# Altium schematic sheet 03-MCU.SchDoc: MCU
size A2; DocumentNumber: 3; SheetNumber: 3; SheetTotal: 5
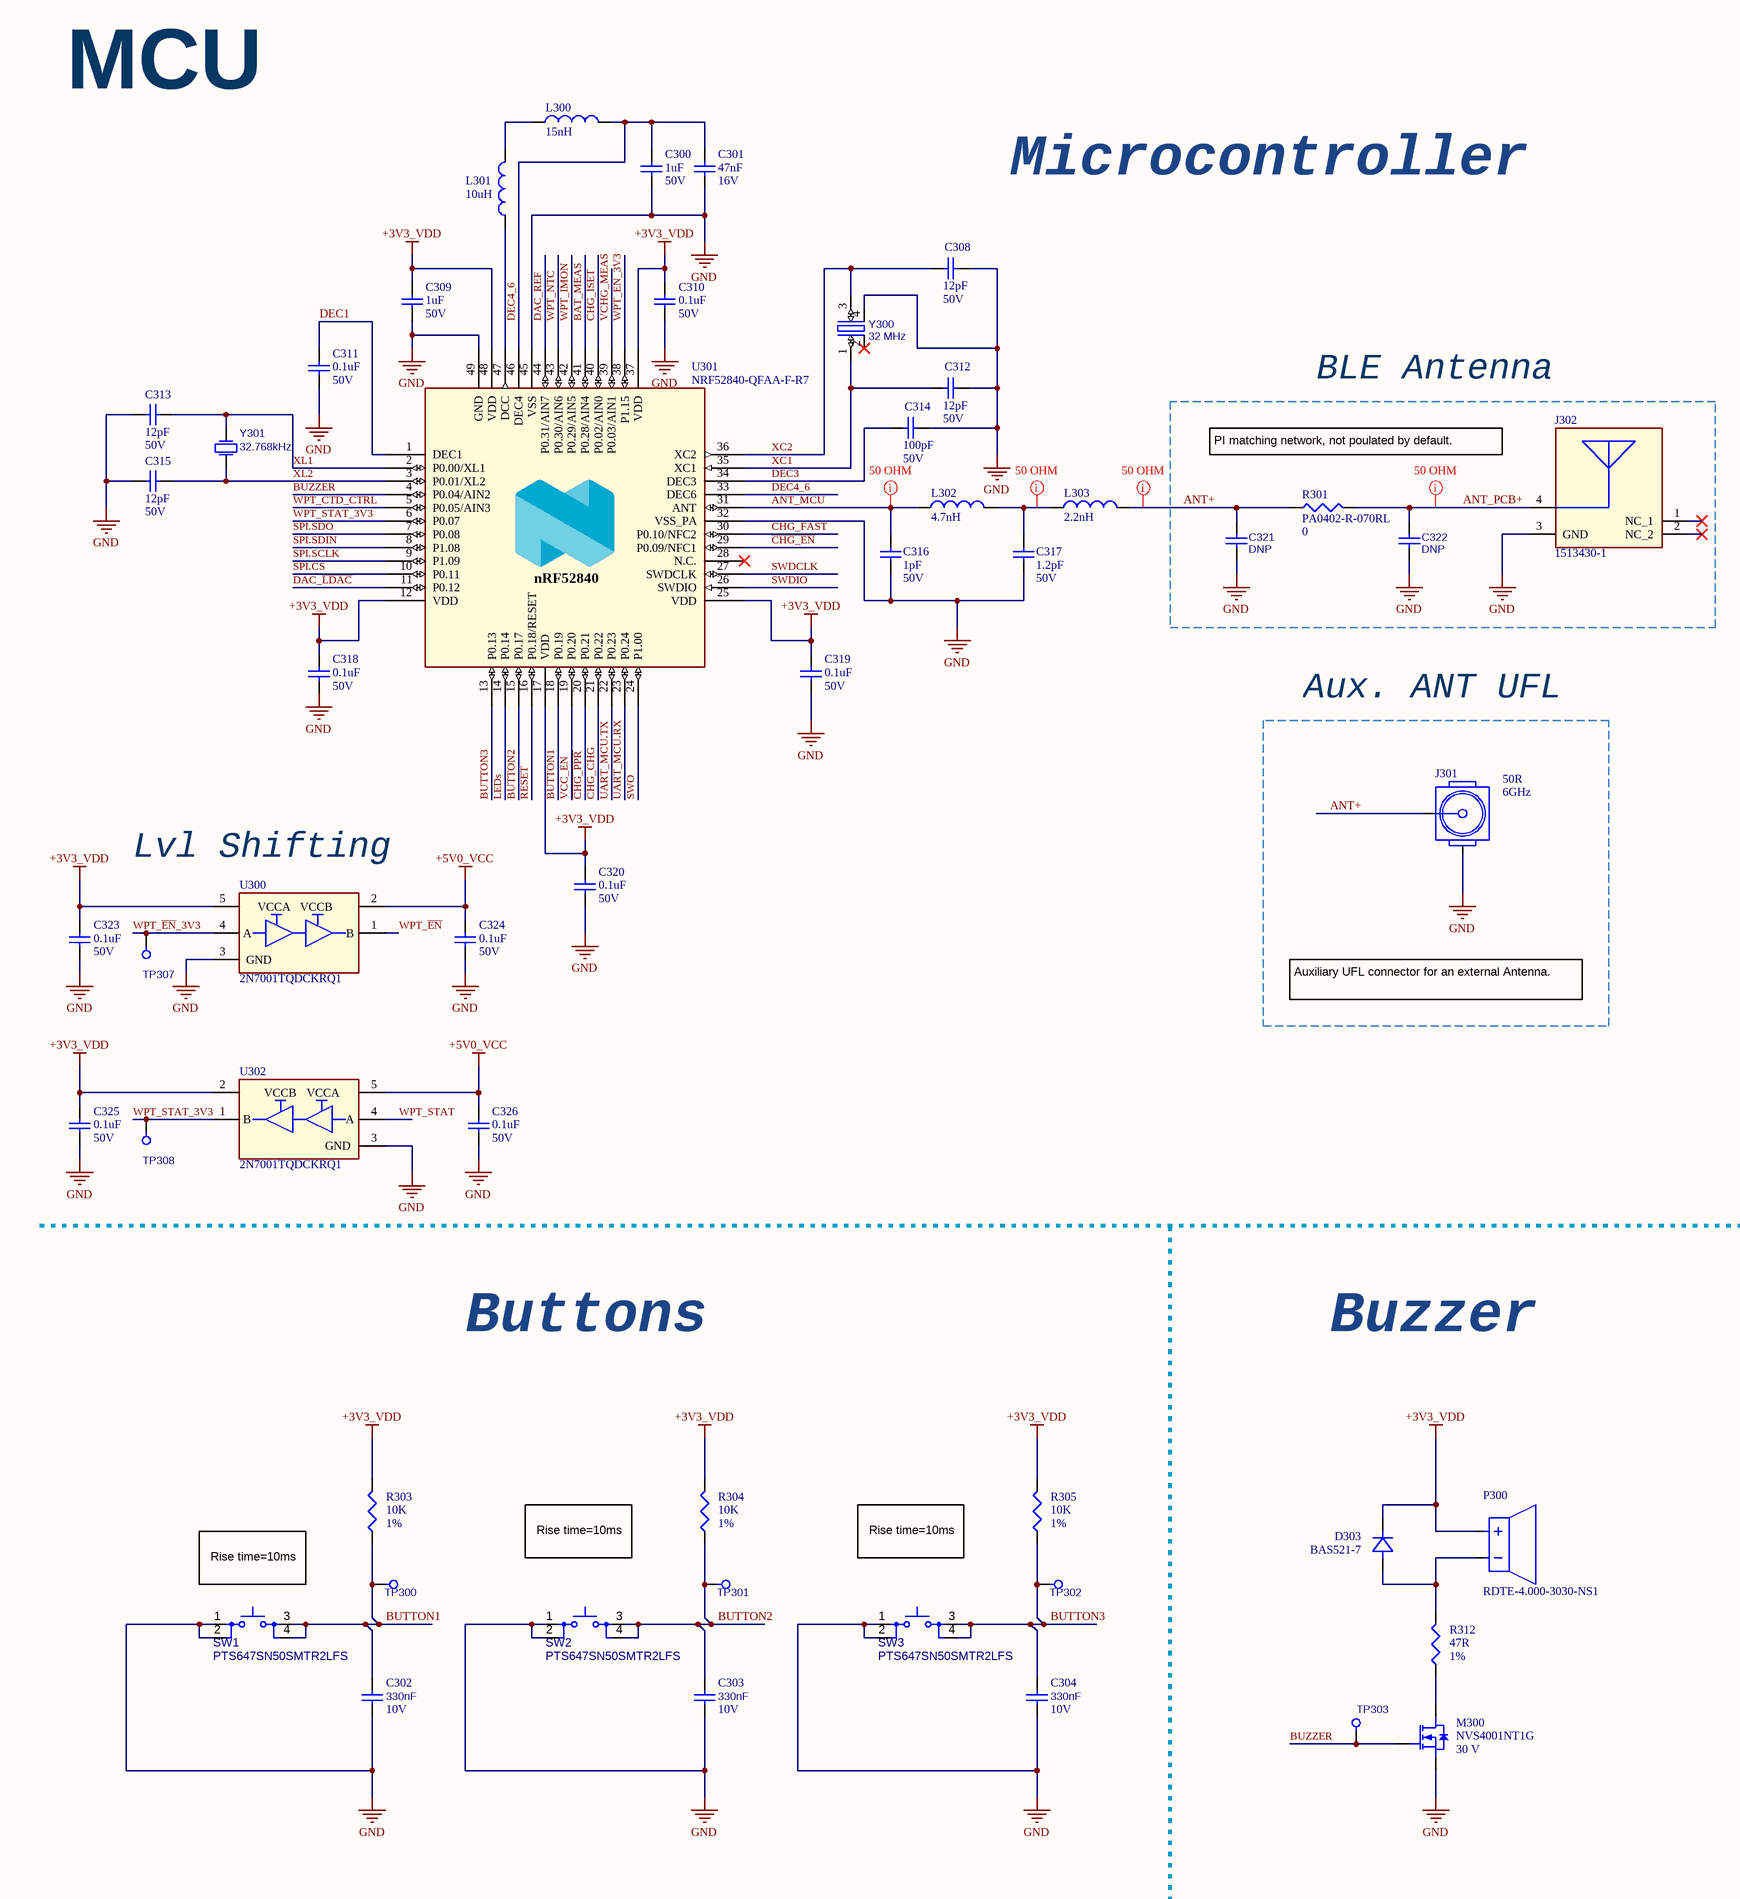
[diagram p0: 03-MCU.SchDoc, left]
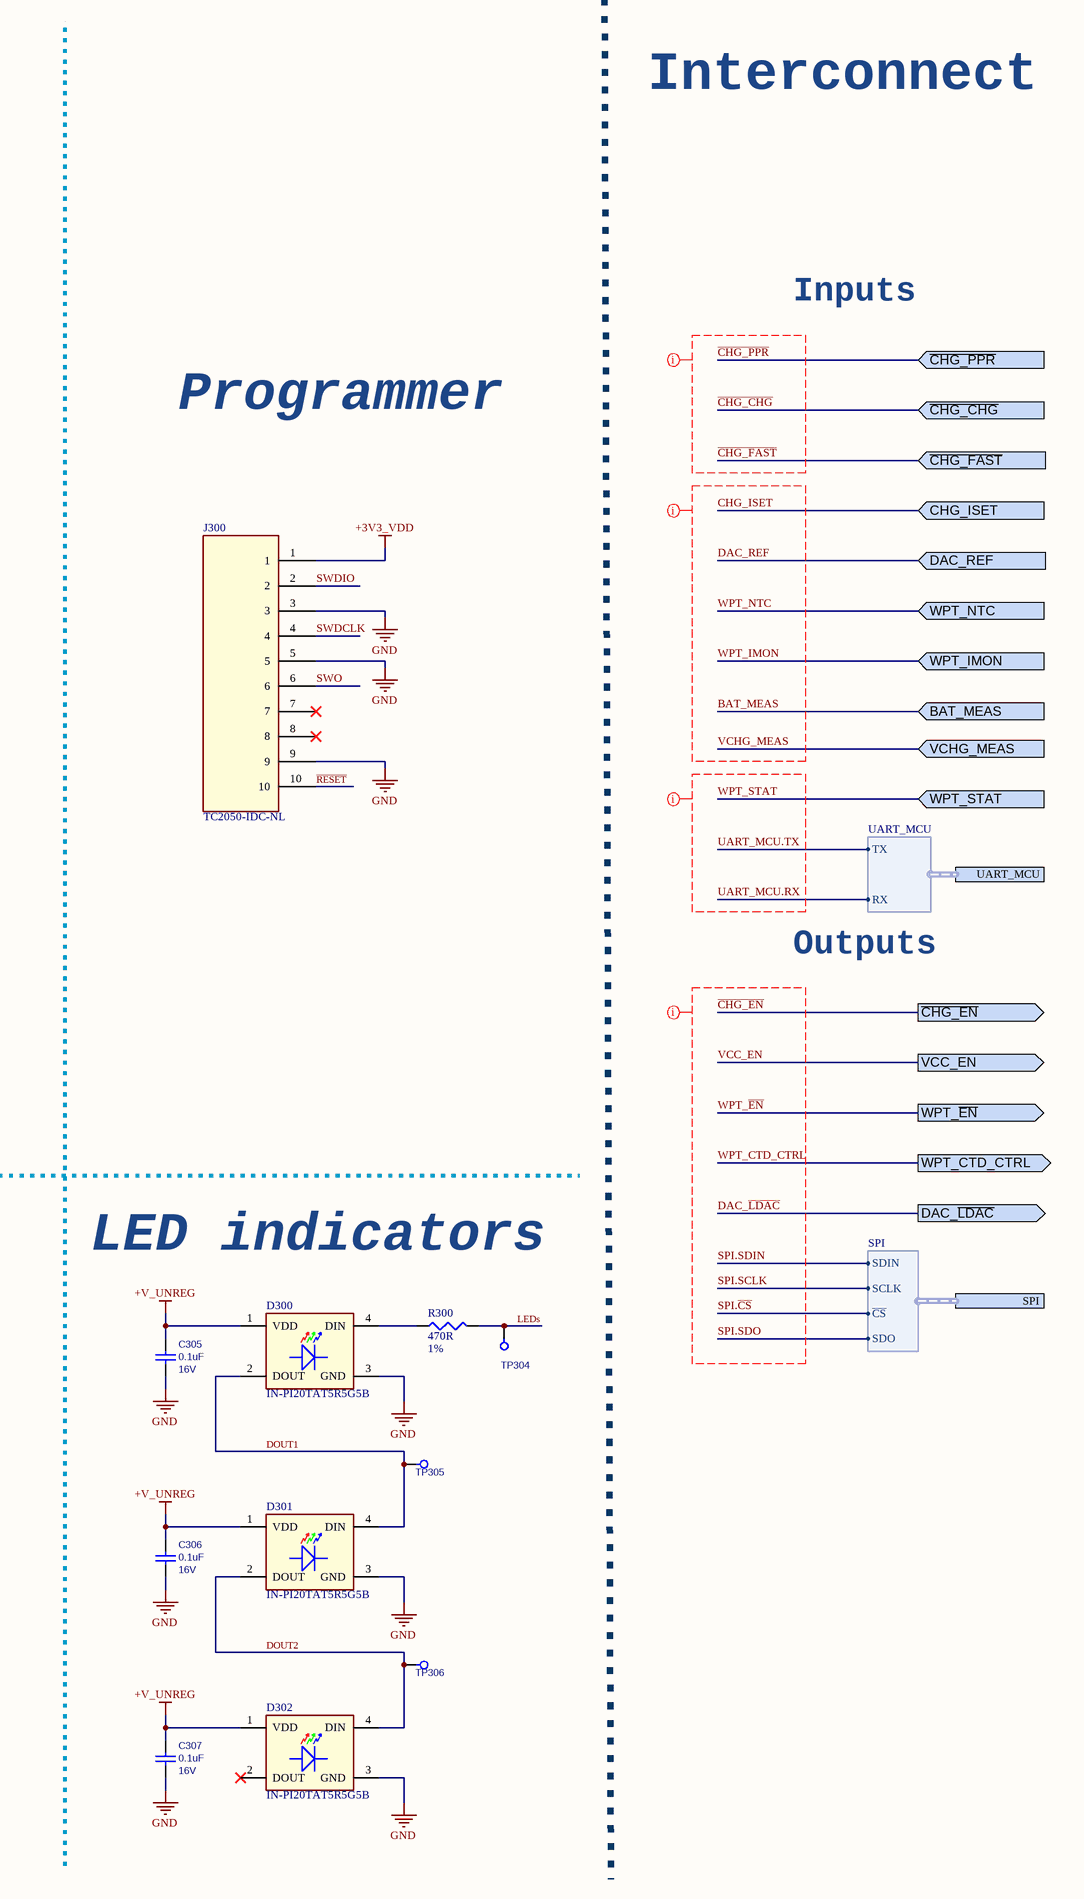
[diagram p1: 03-MCU.SchDoc, right]

## Parts
C300  value 1uF  Voltage Rating: 50V  [C0402]  (hidden comment: GRM155R61H105KE05D)
C301  value 47nF  Voltage Rating: 16V  [C0402]  (hidden comment: GRM155R61C473KA01D)
C302  value 330nF  Rated DC Voltage (URdc): 10V  [C0402]  (hidden comment: GRM155R61A334KE15D)
C303  value 330nF  Rated DC Voltage (URdc): 10V  [C0402]  (hidden comment: GRM155R61A334KE15D)
C304  value 330nF  Rated DC Voltage (URdc): 10V  [C0402]  (hidden comment: GRM155R61A334KE15D)
C305  value 0.1uF  Rating: 16V  [C0402]  (hidden comment: GCM155R71C104KA55)
C306  value 0.1uF  Rating: 16V  [C0402]  (hidden comment: GCM155R71C104KA55)
C307  value 0.1uF  Rating: 16V  [C0402]  (hidden comment: GCM155R71C104KA55)
C308  value 12pF  Voltage Rating: 50V  [C0402]  (hidden comment: GJM1555C1H120FB01D)
C309  value 1uF  Voltage Rating: 50V  [C0402]  (hidden comment: GRM155R61H105KE05D)
C310  value 0.1uF  Voltage Rating: 50V  [C0402]  (hidden comment: GRM155R61H104KE14D)
C311  value 0.1uF  Voltage Rating: 50V  [C0402]  (hidden comment: GRM155R61H104KE14D)
C312  value 12pF  Voltage Rating: 50V  [C0402]  (hidden comment: GJM1555C1H120FB01D)
C313  value 12pF  Voltage Rating: 50V  [C0402]  (hidden comment: GJM1555C1H120FB01D)
C314  value 100pF  Voltage Rating: 50V  [C0402]  (hidden comment: GRM1555C1H101JA01D)
C315  value 12pF  Voltage Rating: 50V  [C0402]  (hidden comment: GJM1555C1H120FB01D)
C316  value 1pF  Voltage Rating: 50V  [C0402]  (hidden comment: GCM1555C1H1R0JA16D)
C317  value 1.2pF  Voltage Rating: 50V  [C0402]  (hidden comment: GJM1555C1H1R2WB01J)
C318  value 0.1uF  Voltage Rating: 50V  [C0402]  (hidden comment: GRM155R61H104KE14D)
C319  value 0.1uF  Voltage Rating: 50V  [C0402]  (hidden comment: GRM155R61H104KE14D)
C320  value 0.1uF  Voltage Rating: 50V  [C0402]  (hidden comment: GRM155R61H104KE14D)
C321  value DNP  [C0402]  (hidden comment: Capacitor, DNP, 0402)
C322  value DNP  [C0402]  (hidden comment: Capacitor, DNP, 0402)
C323  value 0.1uF  Voltage Rating: 50V  [C0402]  (hidden comment: GRM155R61H104KE14D)
C324  value 0.1uF  Voltage Rating: 50V  [C0402]  (hidden comment: GRM155R61H104KE14D)
C325  value 0.1uF  Voltage Rating: 50V  [C0402]  (hidden comment: GRM155R61H104KE14D)
C326  value 0.1uF  Voltage Rating: 50V  [C0402]  (hidden comment: GRM155R61H104KE14D)
D300  IN-PI20TAT5R5G5B  [INPI20TAT5R5G5B]
D301  IN-PI20TAT5R5G5B  [INPI20TAT5R5G5B]
D302  IN-PI20TAT5R5G5B  [INPI20TAT5R5G5B]
D303  BAS521-7  [BAS521_SOD523]
J300  TC2050-IDC-NL  [TC2050-IDC-NL]
J301  Characteristic Impedance: 50R  Operating Frequency-Max: 6GHz  [FP-U_FL-R-SMT-1_10-MFG]  (hidden comment: U.FL-R-SMT-1(10))
J302  1513430-1  [15134301]
L300  value 15nH  [L0402_B]  (hidden comment: LQG15HS15NG02D)
L301  value 10uH  [L0603_B]  (hidden comment: ASMCI-0603-100M-T)
L302  value 4.7nH  [L0402_B]  (hidden comment: LQG15HS4N7B02D)
L303  value 2.2nH  [L0402_B]  (hidden comment: LQG15HS2N2B02D)
M300  NVS4001NT1G  Vds breakdown: 30 V  [NVS4001NT1G-SC-70-3]
P300  RDTE-4.000-3030-NS1  [RDTE-4.000-3030-NS1]
R300  value 470R  Tolerance: 1%  [R0402]  (hidden comment: RC0402FR-13470RL)
R301  PA0402-R-070RL  value 0  [R0402]
R303  value 10K  Tolerance: 1%  [R0402]  (hidden comment: CRCW040210K0FKED)
R304  value 10K  Tolerance: 1%  [R0402]  (hidden comment: CRCW040210K0FKED)
R305  value 10K  Tolerance: 1%  [R0402]  (hidden comment: CRCW040210K0FKED)
R312  value 47R  Tolerance: 1%  [R0402]  (hidden comment: CRCW040247R0FKED)
SW1  PTS647SN50SMTR2LFS  [CK_PTS647]
SW2  PTS647SN50SMTR2LFS  [CK_PTS647]
SW3  PTS647SN50SMTR2LFS  [CK_PTS647]
TP300  Test Point  [testpad_0.9mm]  (value not drawn)  (no BOM)
TP301  Test Point  [testpad_0.9mm]  (value not drawn)  (no BOM)
TP302  Test Point  [testpad_0.9mm]  (value not drawn)  (no BOM)
TP303  Test Point  [testpad_0.9mm]  (value not drawn)  (no BOM)
TP304  Test Point  [testpad_0.9mm]  (value not drawn)  (no BOM)
TP305  Test Point  [testpad_0.9mm]  (value not drawn)  (no BOM)
TP306  Test Point  [testpad_0.9mm]  (value not drawn)  (no BOM)
TP307  Test Point  [testpad_0.9mm]  (value not drawn)  (no BOM)
TP308  Test Point  [testpad_0.9mm]  (value not drawn)  (no BOM)
U300  2N7001TQDCKRQ1  [SOT65P210X110-5N]
U301  NRF52840-QFAA-F-R7  [QFN40P600X600X90-48N]
U302  2N7001TQDCKRQ1  [SOT65P210X110-5N]
Y300  value 32 MHz  [XTAL_ECS-SMD-CRYSTAL-10-48-CKY-TR]  (hidden comment: ECS-320-10-48-CKY-TR)
Y301  value 32.768kHz  [XTAL_ECS-.327-9-34B-C-TR]  (hidden comment: ECS-.327-9-34B-C-TR)

## Blocks framed on the sheet
BLE Antenna: C321 C322 J302 R301
Aux. ANT UFL: J301

## Ports
BAT_MEAS (in), CHG_ISET (in), DAC_REF (in), DAC_~{LDAC} (out), SPI (harness SPI), UART_MCU (harness UART_MCU), VCC_EN (out), VCHG_MEAS (in), WPT_CTD_CTRL (out), WPT_IMON (in), WPT_NTC (in), WPT_STAT (in), WPT_~{EN} (out), ~{CHG_CHG} (in), ~{CHG_EN} (out), ~{CHG_FAST} (in), ~{CHG_PPR} (in)

## Harnesses
UART_MCU: TX, RX
SPI: SDIN, SCLK, ~{CS}, SDO

## Nets
+3V3_VDD: C309.2 C310.2 C318.2 C319.2 C320.2 C323.2 C325.2 D303.1 J300.1 P300.1(+) R303.2 R304.2 R305.2 U300.5(VCCA) U301.12(VDD) U301.17(VDD) U301.25(VDD) U301.37(VDD) U301.48(VDD) U302.2(VCCB)
+5V0_VCC: C324.2 C326.2 U300.2(VCCB) U302.5(VCCA)
+V_UNREG: C305.2 C306.2 C307.2 D300.1(VDD) D301.1(VDD) D302.1(VDD)
GND: C300.1 C301.1 C302.1 C303.1 C304.1 C305.1 C306.1 C307.1 C308.2 C309.1 C310.1 C311.1 C312.2 C313.1 C314.2 C315.1 C316.1 C317.1 C318.1 C319.1 C320.1 C321.1 C322.1 C323.1 C324.1 C325.1 C326.1 D300.3(GND) D301.3(GND) D302.3(GND) J300.3 J300.5 J300.9 J301.2 J302.3(GND) M300.2(S) SW1.1 SW1.2 SW2.1 SW2.2 SW3.1 SW3.2 U300.3(GND) U301.32(VSS_PA) U301.45(VSS) U301.49(GND) U302.3(GND) Y300.4(GND)
ANT+: C321.2 J301.1 L303.2 R301.1
ANT_MCU: C316.2 L302.1 U301.31(ANT)
ANT_PCB+: C322.2 J302.4(50_OHM_FEED_POINT) R301.2
BAT_MEAS: U301.41(P0.28/AIN4) ; port BAT_MEAS
BUTTON1: C302.2 R303.1 SW1.3 SW1.4 TP300.1 U301.18(P0.19)
BUTTON2: C303.2 R304.1 SW2.3 SW2.4 TP301.1 U301.15(P0.17)
BUTTON3: C304.2 R305.1 SW3.3 SW3.4 TP302.1 U301.13(P0.13)
BUZZER: M300.1(G) TP303.1 U301.4(P0.04/AIN2)
~{CHG_CHG}: U301.21(P0.22) ; port ~{CHG_CHG}
~{CHG_EN}: U301.29(P0.09/NFC1) ; port ~{CHG_EN}
~{CHG_FAST}: U301.30(P0.10/NFC2) ; port ~{CHG_FAST}
~{CHG_PPR}: U301.20(P0.21) ; port ~{CHG_PPR}
CHG_ISET: U301.40(P0.02/AIN0) ; port CHG_ISET
DAC_~{LDAC}: U301.11(P0.12) ; port DAC_~{LDAC}
DAC_REF: U301.44(P0.31/AIN7) ; port DAC_REF
DEC1: C311.2 U301.1(DEC1)
DEC3: C314.1 U301.34(DEC3)
DEC4_6: C300.2 C301.2 L300.2 U301.33(DEC6) U301.46(DEC4)
DOUT1: D300.2(DOUT) D301.4(DIN) TP305.1
DOUT2: D301.2(DOUT) D302.4(DIN) TP306.1
LEDs: R300.2 TP304.1 U301.14(P0.14)
~{RESET}: J300.10 U301.16(P0.18/RESET)
SPI.~{CS}: U301.10(P0.11) ; port SPI.~{CS}
SPI.SCLK: U301.9(P1.09) ; port SPI.SCLK
SPI.SDIN: U301.8(P1.08) ; port SPI.SDIN
SPI.SDO: U301.7(P0.08) ; port SPI.SDO
SWDCLK: J300.4 U301.27(SWDCLK)
SWDIO: J300.2 U301.26(SWDIO)
SWO: J300.6 U301.24(P1.00)
UART_MCU.RX: U301.23(P0.24) ; port UART_MCU.RX
UART_MCU.TX: U301.22(P0.23) ; port UART_MCU.TX
VCC_EN: U301.19(P0.20) ; port VCC_EN
VCHG_MEAS: U301.39(P0.03/AIN1) ; port VCHG_MEAS
WPT_CTD_CTRL: U301.5(P0.05/AIN3) ; port WPT_CTD_CTRL
WPT_~{EN}: U300.1(B) ; port WPT_~{EN}
WPT_~{EN}_3V3: TP307.1 U300.4(A) U301.38(P1.15)
WPT_IMON: U301.42(P0.29/AIN5) ; port WPT_IMON
WPT_NTC: U301.43(P0.30/AIN6) ; port WPT_NTC
WPT_STAT: U302.4(A) ; port WPT_STAT
WPT_STAT_3V3: TP308.1 U301.6(P0.07) U302.1(B)
XC1: C312.1 U301.35(XC1) Y300.1(IN/OUT)
XC2: C308.1 U301.36(XC2) Y300.3(OUT/IN)
XL1: C313.2 U301.2(P0.00/XL1) Y301.2
XL2: C315.2 U301.3(P0.01/XL2) Y301.1
NetC317_2: C317.2 L302.2 L303.1
NetD300_4: D300.4(DIN) R300.1
NetD303_2: D303.2 P300.2(-) R312.2
NetL300_1: L300.1 L301.2
NetL301_1: L301.1 U301.47(DCC)
NetM300_3: M300.3(D) R312.1

Not connected (* = marked no-connect by the designer): D302 2(DOUT)*; J300 7* 8*; J302 1(NC_1)* 2(NC_2)*; U301 28(N.C.)*; Y300 2(NC)*

## Layout directives
net class DIGITAL: DAC_~{LDAC}, SPI.SCLK, SPI.SDIN, SPI.SDO, SPI.~{CS}, UART_MCU.RX, UART_MCU.TX, VCC_EN, WPT_CTD_CTRL, WPT_STAT, WPT_~{EN}, ~{CHG_CHG}, ~{CHG_EN}, ~{CHG_FAST}, ~{CHG_PPR}
net class ANALOG: BAT_MEAS, CHG_ISET, DAC_REF, VCHG_MEAS, WPT_IMON, WPT_NTC
net class 50_OHM; rule Impedance Constraint [Min = 50.00    Max = 50.00    ]: ANT+, ANT_MCU, ANT_PCB+, NetC317_2

## Notes on the sheet
- MCU
- Interconnect
- Microcontroller
- Inputs
- PI matching network, not poulated by default.
- Programmer
- (near U300) Lvl Shifting
- Auxiliary UFL connector for an external Antenna.
- Outputs
- LED indicators
- Buttons
- Buzzer
- (near SW1) Rise time=10ms
- Rise time=10ms
- Project:
- Schematic:
- Design by:
- Date:
- Ver:
- .
- Comments:
- Reviewed by:
- (in symbol NRF52840-QFAA-F-R7) nRF52840

## Library data of the parts
C300 C309 = GRM155R61H105KE05D: 1 µF ±10% 50V Ceramic Capacitor X5R 0402 (1005 Metric); Manufacturer: Murata Electronics; Category: Capacitor; Temperature Coefficient: X5R; Manufacturer Part Number: GRM155R61H105KE05D; Medical Grade Manufacturer: *; Medical Grade Manufacturer Part Number: *; Size Code: 0402; Supplier: *; Supplier Part Number: *; Height: 0.60mm; Width: 0.50mm; Length: 1.00mm; Tolerance: ±10%; Supplier 1: Digikey; Supplier Part Number 1: 490-GRM155R61H105KE05DCT-ND
C301 = GRM155R61C473KA01D: 0.047 µF ±10% 16V Ceramic Capacitor X5R 0402 (1005 Metric); Manufacturer: Murata Electronics; Category: Capacitor; Temperature Coefficient: X5R; Manufacturer Part Number: GRM155R61C473KA01D; Medical Grade Manufacturer: *; Medical Grade Manufacturer Part Number: *; Size Code: 0402; Supplier: *; Supplier Part Number: *; Height: 0.55mm; Width: 0.50mm; Length: 1.00mm; Tolerance: ±10%; Supplier 1: Digikey; Supplier Part Number 1: 490-6313-1-ND
C302-C304 = GRM155R61A334KE15D: Ceramic Capacitor, Multilayer, Ceramic, 10V, 10% +Tol, 10% -Tol, X5R, 15% TC, 0.33uF, Surface Mount, 0402; Manufacturer: Murata; Multilayer: Yes; Supplier: Arrow Electronics; Supplier Part Number: GRM155R61A334KE15D; Manufacturer Part Number: GRM155R61A334KE15D; RoHS: Yes; Category: Ceramic Capacitors; Stock: 42823; Pricing: 1=0,1103, 10=0,0933, 25=0,0752, 100=0,0508, 250=0,0502, 500=0,0438, 1000=0,0295, 3000=0,028, 6000=0,025, 15000=0,0191, 30000=0,0185 (USD); Mounting Technology: Surface Mount; Pins: 2; Dielectric Material: Ceramic; Package Shape: Rectangular; Case/Package: 0402; Terminal Finish: Nickel; Min Operating Temperature: -55°C; Max Operating Temperature: 85°C; JESD-609 Code: e3; Capacitor Type: Ceramic; Tolerance  (fill in as +-): 10%; Package Style: SMTMeter; Packaging: Tape and Reel; Tolerance (fill in as +-): 10%; Temperature Characteristics Code: X5R; Termination: Wraparound; Length: 1mm; Width: 0.5mm; Height: 0.5mm; Reach SVHC Compliant: Yes; RoHS Compliant: Yes; ComponentLink1URL: https://datasheet.ciiva.com:443/pdfs/VipMasterIC/IC/MURE/MURE-S-A0004362469/MURE-S-A0004364266-1.pdf?src-supplier=IHS+Markit; ComponentLink1Description: https://datasheet.ciiva.com:443/pdfs/VipMasterIC/IC/MURE/MURE-S-A0004362469/MURE-S-A0004364266-1.pdf?src-supplier=IHS+Markit; ComponentLink2URL: https://datasheet.ciiva.com/133/product-133232.pdf?src-supplier=Digi-Key; ComponentLink2Description: https://datasheet.ciiva.com/133/product-133232.pdf?src-supplier=Digi-Key; ComponentLink3URL: https://datasheet.ciiva.com/18184/getdatasheetpartid-223890-18184604.pdf?src-supplier=Verical; ComponentLink3Description: https://datasheet.ciiva.com/18184/getdatasheetpartid-223890-18184604.pdf?src-supplier=Verical; ComponentLink4URL: https://datasheet.ciiva.com/29200/453519-da-01-en-vs-kondensator-0402-29200242.pdf?src-supplier=Conrad; ComponentLink4Description: https://datasheet.ciiva.com/29200/453519-da-01-en-vs-kondensator-0402-29200242.pdf?src-supplier=Conrad; ComponentLink5URL: https://datasheet.ciiva.com/133/grm155r61a334ke15-01-133233.pdf?src-supplier=Digi-Key; ComponentLink5Description: https://datasheet.ciiva.com/133/grm155r61a334ke15-01-133233.pdf?src-supplier=Digi-Key; ComponentLink6URL: https://datasheet.ciiva.com/5421/product-5421467.pdf?src-supplier=Mouser; ComponentLink6Description: https://datasheet.ciiva.com/5421/product-5421467.pdf?src-supplier=Mouser; ComponentLink7URL: https://datasheet.ciiva.com/11463/product-11463963.pdf?src-supplier=Avnet; ComponentLink7Description: https://datasheet.ciiva.com/11463/product-11463963.pdf?src-supplier=Avnet; Supplier 1: Mouser; Supplier Part Number 1: 81-GRM155R61A334KE5D; Supplier 2: Digikey; Supplier Part Number 2: 490-3263-1-ND; Supplier 3: Digikey; Supplier Part Number 3: 490-3263-6-ND; Supplier 4: Digikey; Supplier Part Number 4: 490-3263-2-ND
C305-C307 = GCM155R71C104KA55: Capacitor, 0.1uF, X7R, 16V, 10%, 0402, Implant-grade; Manufacturer: Murata; Medical Grade MFR PN: GCH155R71C104KE01; PCB Footprint: cap0402_reduced; Length (mm): 1.00 ±0.05; Manufacturer Part Number: GCM155R71C104KA55; Medical Grade MFR: Murata; Thickness (mm): 0.50 ±0.05; Width (mm): 0.50 ±0.05; Category: Capacitor; Package Description: 0402; Supplier 1: Digikey; Supplier Part Number 1: 490-4759-1-ND
C308 C312 C313 C315 = GJM1555C1H120FB01D: 12 pF ±1% 50V Ceramic Capacitor C0G, NP0 0402 (1005 Metric); Manufacturer: Murata Electronics; Category: Capacitor; Temperature Coefficient: C0G, NP0; Manufacturer Part Number: GJM1555C1H120FB01D; Medical Grade Manufacturer: *; Medical Grade Manufacturer Part Number: *; Size Code: 0402; Supplier: *; Supplier Part Number: *; Height: 0.55mm; Width: 0.50mm; Length: 1.00mm; Tolerance: ±1%; Supplier 1: Digikey; Supplier Part Number 1: 490-11190-1-ND
C310 C311 C318-C320 C323-C326 = GRM155R61H104KE14D: 0.1 µF ±10% 50V Ceramic Capacitor X5R 0402 (1005 Metric); Manufacturer: Murata Electronics; Category: Capacitor; Temperature Coefficient: X5R; Manufacturer Part Number: GRM155R61H104KE14D; Medical Grade Manufacturer: *; Medical Grade Manufacturer Part Number: *; Size Code: 0402; Supplier: *; Supplier Part Number: *; Height: 0.55mm; Width: 0.50mm; Length: 1.00mm; Tolerance: ±10%; Supplier 1: Digikey; Supplier Part Number 1: 490-10697-1-ND
C314 = GRM1555C1H101JA01D: 100 pF ±5% 50V Ceramic Capacitor C0G, NP0 0402 (1005 Metric); Manufacturer: Murata Electronics; Category: Capacitor; Temperature Coefficient: C0G, NP0; Manufacturer Part Number: GRM1555C1H101JA01D; Medical Grade Manufacturer: *; Medical Grade Manufacturer Part Number: *; Size Code: 0402; Supplier: *; Supplier Part Number: *; Height: 0.55mm; Width: 0.50mm; Length: 1.00mm; Tolerance: ±5%; Supplier 1: Digikey; Supplier Part Number 1: 490-5922-1-ND
C316 = GCM1555C1H1R0JA16D: 1 pF ±5% 50V Ceramic Capacitor C0G, NP0 0402 (1005 Metric); Manufacturer: Murata Electronics; Category: Capacitor; Temperature Coefficient: C0G, NP0; Manufacturer Part Number: GCM1555C1H1R0JA16D; Medical Grade Manufacturer: *; Medical Grade Manufacturer Part Number: *; Size Code: 0402; Supplier: *; Supplier Part Number: *; Height: 0.55mm; Width: 0.50mm; Length: 1.00mm; Tolerance: ±5%; Supplier 1: Digikey; Supplier Part Number 1: 490-GCM1555C1H1R0JA16DCT-ND
C317 = GJM1555C1H1R2WB01J: 1.2 pF ±0.05pF 50V Ceramic Capacitor C0G, NP0 0402 (1005 Metric); Manufacturer: Murata Electronics; Category: Capacitor; Temperature Coefficient: C0G, NP0; Manufacturer Part Number: GJM1555C1H1R2WB01J; Medical Grade Manufacturer: *; Medical Grade Manufacturer Part Number: *; Size Code: 0402; Supplier: *; Supplier Part Number: *; Height: 0.55mm; Width: 0.50mm; Length: 1.00mm; Tolerance: ±0.05pF; Supplier 1: Digikey; Supplier Part Number 1: 490-GJM1555C1H1R2WB01JCT-ND
C321 C322 = CAP_DNP_0402: DNP: Capacitor, DNP, 0402; PCB Footprint: cap0402_reduced; Rating: 25V; Review: 020823; Length (mm): 1.00 ±0.10; Manufacturer: N/A; Manufacturer PN: N/A; Medical Grade MFR: N/A; Medical Grade MFR PN: N/A; Thickness (mm): 0.40 ±0.10; Width (mm): 0.55 ±0.07; Category: Capacitor; Package Description: 0402; Status: Approved
D300-D302 = IN-PI20TAT5R5G5B: Addressable Lighting - 1 LED Discrete Red, Green, Blue (RGB) 2.0mm L x 2.0mm W; Manufacturer: Inolux; Manufacturer Part Number: IN-PI20TAT5R5G5B; Color: RGB; Mounting type: SMD; Lenght: 2.0mm; Width: 2.0mm; Supplier 1: Digikey; Supplier Part Number 1: 1830-IN-PI20TAT5R5G5BCT-ND; Supplier 2: Digikey; Supplier Part Number 2: 1830-IN-PI20TAT5R5G5BDKR-ND; Supplier 3: Digikey; Supplier Part Number 3: 1830-IN-PI20TAT5R5G5BTR-ND; Supplier 4: Mouser; Supplier Part Number 4: 743-IN-PI20TAT5R5G5B
D303 = BAS521-7: Diode 300 V 250mA Surface Mount SOD-523; Manufacturer: Diodes Incorporated; Type: General Purpose; Number of Channels: 1; Forward Voltage: 1.1V; Reverse Voltage: 300V; Reverse Current: 150nA; Diode Capacitance: 5pF; Category: Diode; Manufacturer Part Number: BAS521-7; Mounting Type: SMD; Forward Current: 250mA; Supplier 1: Digikey; Supplier Part Number 1: BAS521-7DICT-ND
J300 = TC2050-IDC-NL: Cbl Plug-Of-Nails 10-Pin 1.27mm; Manufacturer: Tag-Connect LLC; Connector Type: Male Pin; Pitch - Matching: 0.050"; Number of Positions: 10; Manufacturer Part Number: TC2050-IDC-NL; Number of Rows: 2; Supplier 1: Digikey; Supplier Part Number 1: TC2050-IDC-NL-ND
J301 = U.FL-R-SMT-1(10): RF Connector, 1 Contact(s), Male, Board Mount, Surface Mount Terminal, Receptacle; pin to pad: 2>2+3; Manufacturer: Hirose; Durability: 30Cycles; Insulation Resistance: 500MR; Number of Ports: 1; Option: General Purpose; Contact Resistance: 20mR; Contact Style: Coax; Coupling Type: Snap; Dielectric Withstanding Voltage (AC): 200V; Filter Feature: No; Mating Information: MULTIPLE MATING PARTS AVAILABLE; Panel Mount: No; VSWR: 1.5; Insertion Loss: 0.05dB; Body Depth: 0.098inch; Mounting Option 1: LOCKING; Body Diameter: 0.079inch; Reference Standard: UL; Reliability: COMMERCIAL; Supplier: Digi-Key; Supplier Part Number: H11891CT-ND; RoHS: Yes; Category: RF / Coaxial Connectors; Stock: 112692; Pricing: 1=1,35, 10=1,138, 25=1,092, 50=1,0686, 100=1,0221, 250=0,9292, 500=0,83628, 1000=0,74336 (USD); Mounting Technology: Board; Insulation Material: Polymer; Shell Finish: Silver; Shell Material: CuSn; Contact Material: Bronze; Contact Finish - Mating: GOLD; Contact Finish - Termination: GOLD; Insulation Color: Beige; Min Operating Temperature: -40°C; Max Operating Temperature: 90°C; Connector Type: RF CONNECTOR; Body/Shell Style: RECEPTACLE; Contact Gender: Male; Mounting Style: STRAIGHT; Termination: SMD/SMT; Number of Contacts: 1; JESD-609 Code: e4; Reach SVHC Compliant: Yes; RoHS Compliant: Yes; DIN Conformance: No; IEC Conformance: No; MIL Conformance: No; ComponentLink1URL: https://datasheet.ciiva.com:443/pdfs/VipMasterIC/IC/HIRO/HIROS10696/HIROS08829-1.pdf?src-supplier=IHS+Markit; ComponentLink1Description: https://datasheet.ciiva.com:443/pdfs/VipMasterIC/IC/HIRO/HIROS10696/HIROS08829-1.pdf?src-supplier=IHS+Markit; ComponentLink2URL: https://datasheet.ciiva.com/11762/0900766b8105243f-11762474.pdf?src-supplier=Rs; ComponentLink2Description: https://datasheet.ciiva.com/11762/0900766b8105243f-11762474.pdf?src-supplier=Rs; ComponentLink3URL: https://datasheet.ciiva.com/7651/91524-7651914.pdf?src-supplier=Element14; ComponentLink3Description: https://datasheet.ciiva.com/7651/91524-7651914.pdf?src-supplier=Element14; ComponentLink4URL: https://datasheet.ciiva.com/7651/91524-7651915.pdf?src-supplier=Element14; ComponentLink4Description: https://datasheet.ciiva.com/7651/91524-7651915.pdf?src-supplier=Element14; Manufacturer Part Number: U.FL-R-SMT-1(10); Supplier 1: Digikey; Supplier Part Number 1: H11891CT-ND
J302 = 1513430-1: BLE 2.45 GHz SMD Antenna.; Manufacturer: TE Connectivity; Impedance: 50 Ohm; Gain: 0 dB; Power Rating: 10 W; VSWR: 2:1; Protocol: 802.15.11, BLE; Minimum Frequency: 2.4 GHz; Maximum Frequency: 2.484 GHz; Category: Antenna; Type: Passive Antenna; Manufacturer Part Number: 1513430-1; Supplier: TBD; Supplier Part Number: TBD; Mounting Style: SMD; Height: 0.79mm; Width: 3.76mm; Length: 12.85mm; Center Frequency: 2.45 GHz; Supplier 1: Mouser; Supplier Part Number 1: 571-1513430-1; Supplier 2: Digikey; Supplier Part Number 2: A108788CT-ND; Supplier 3: Digikey; Supplier Part Number 3: A108788TR-ND
L300 = LQG15HS15NG02D: 15 nH Unshielded Multilayer Inductor 450 mA 320mOhm Max 0402 (1005 Metric); Manufacturer: Murata Electronics; Tolerance: ±2%; Current Rating: 450 mA; DC Resistance: 320m; Category: Inductor; Manufacturer Part Number: LQG15HS15NG02D; Medical Grade Manufacturer: *; Medical Grade Manufacturer Part Number: *; Size Code: 0402; Supplier: *; Supplier Part Number: *; Height: 0.55mm; Width: 0.50mm; Length: 1.00mm; Current Saturation: *; Shielding: Unshielded; Supplier 1: Digikey; Supplier Part Number 1: 490-LQG15HS15NG02DCT-ND
L301 = ASMCI-0603-100M-T: 10 µH Shielded Multilayer Inductor 50 mA 900mOhm 0603 (1608 Metric); Manufacturer: Abracon LLC; Tolerance: ±20%; Current Rating: 50 mA; DC Resistance: 900m; Category: Inductor; Manufacturer Part Number: ASMCI-0603-100M-T; Medical Grade Manufacturer: *; Medical Grade Manufacturer Part Number: *; Size Code: 0603; Supplier: *; Supplier Part Number: *; Height: 0.95mm; Width: 0.80mm; Length: 1.60mm; Current Saturation: *; Shielding: Shielded; Supplier 1: Digikey; Supplier Part Number 1: 535-12249-1-ND
L302 = LQG15HS4N7B02D: 4.7 nH Unshielded Multilayer Inductor 700 mA 160mOhm Max 0402 (1005 Metric); Manufacturer: Murata Electronics; Tolerance: ±0.1nH; Current Rating: 700 mA; DC Resistance: 160m; Category: Inductor; Manufacturer Part Number: LQG15HS4N7B02D; Medical Grade Manufacturer: *; Medical Grade Manufacturer Part Number: *; Size Code: 0402; Supplier: *; Supplier Part Number: *; Height: 0.55mm; Width: 0.50mm; Length: 1.00mm; Current Saturation: *; Shielding: Unshielded; Supplier 1: Digikey; Supplier Part Number 1: 490-LQG15HS4N7B02DCT-ND
L303 = LQG15HS2N2B02D: 2.2 nH Unshielded Multilayer Inductor 900 mA 90mOhm Max 0402 (1005 Metric); Manufacturer: Murata Electronics; Tolerance: ±0.1nH; Current Rating: 900 mA; DC Resistance: 90m; Category: Inductor; Manufacturer Part Number: LQG15HS2N2B02D; Medical Grade Manufacturer: *; Medical Grade Manufacturer Part Number: *; Size Code: 0402; Supplier: *; Supplier Part Number: *; Height: 0.55mm; Width: 0.50mm; Length: 1.00mm; Current Saturation: *; Shielding: Unshielded; Supplier 1: Digikey; Supplier Part Number 1: 490-LQG15HS2N2B02DCT-ND
M300 = NVS4001NT1G: N-Channel 30 V 270mA (Ta) 330mW (Ta) Surface Mount SC-70-3 (SOT323); Manufacturer: onsemi; Number of Channels: 1; Vgs max: ±20V; Vgs th: 1.2V; Rds On: 1Ohm; Category: Transistor; Type: N-MOS; Mounting Type: SMD; Power Dissipation: 330mW; Id, drain  DC current max: 270mA; Manufacturer Part Number: NVS4001NT1G; Supplier 1: Digikey; Supplier Part Number 1: NVS4001NT1GOSCT-ND
P300 = RDTE-4.000-3030-NS1: Buzzers Transducer, Externally Driven Magnetic 3 V 120mA 4kHz 72dB @ 3V, 10cm Surface Mount Solder Pads; Manufacturer: Raltron Electronics; Voltage Range: 2 ~ 4V; Manufacturer Part Number: RDTE-4.000-3030-NS1; Frequency: 4kHz; Current supply: 120mA; Mounting Type: SMD; Supplier 1: Digikey; Supplier Part Number 1: 2151-RDTE-4.000-3030-NS1CT-ND
R300 = RC0402FR-13470RL: Res Thick Film 0402 470 Ohm 1% 1/16W ±100ppm/°C Molded SMD SMD Paper T/R; Manufacturer: Yageo; Power Rating: 62.5mW; Voltage Rating: 50V; Supplier Part Number: 32AK1000; Manufacturer Part Number: RC0402FR-13470RL; RoHS: Yes; Category: Chip SMD Resistors; Stock: 249870; Pricing: 1=0.10000, 10=0.01800, 25=0.01500, 50=0.01100, 100=0.00800 (USD); Case/Package: 0402; Case Code (Imperial): 0402; Case Code (Metric): 1005; Contact Plating: Tin,Matte; Min Operating Temperature: -55°C; Max Operating Temperature: 155°C; Packaging: Tape and Reel; Series: RC; Resistor Type: Thick Film; Temperature Coefficient: 100ppm/°C; Termination: SMD/SMT; Length: 1mm; Width: 0.5mm; Height: 0.35mm; Radiation Hardening: No; ComponentLink1URL: https://datasheet.ciiva.com/5602/pyu-rc0402-51-rohs-l-6-r-8721-5602095.pdf?src-supplier=Mouser; ComponentLink1Description: https://datasheet.ciiva.com/5602/pyu-rc0402-51-rohs-l-6-r-8721-5602095.pdf?src-supplier=Mouser; Supplier 1: Digikey; Supplier Part Number 1: 13-RC0402FR-13470RLCT-ND
R301 = PA0402-R-070RL: Resistor, 0 Ohm, 0402, Metal element, Non-Implant grade,; Manufacturer: YAGEO; Power: 62.5mW; Temperature Coefficient: 150 ppm/°C; Category: Resistor; Manufacturer Part Number: PA0402-R-070RL; Medical Grade Manufacturer: -; Medical Grade Manufacturer Part Number: -; Size Code: 0402; Supplier: TBD; Supplier Part Number: TBD; Height: 0.35mm; Width: 0.55m; Length: 1.0mm; Voltage Rating: *; Supplier 1: Digikey; Supplier Part Number 1: YAG5756CT-ND; Supplier 2: Digikey; Supplier Part Number 2: YAG5756DKR-ND; Supplier 3: Digikey; Supplier Part Number 3: YAG5756TR-ND; Supplier 4: Mouser; Supplier Part Number 4: 603-PA0402-R-070RL
R303-R305 = CRCW040210K0FKED: Res Thick Film 0402 10K Ohm 1% 1/16W ±100ppm/°C Molded SMD SMD Paper T/R; Manufacturer: Vishay Dale; Power Rating: 63mW; Voltage Rating: 50V; Case Code (Metric): 1005; Features: Automotive AEC-Q200; Termination: SMD/SMT; Mount: Surface Mount; Case Code (Imperial): 0402; Lead Free: Lead Free; Max Power Dissipation: 63mW; Number of Terminations: 2; Number of Pins: 2; Composition: Thick Film; Case/Package: 0402; Temperature Coefficient: 100ppm/°C; Min Operating Temperature: -55°C; Max Operating Temperature: 155°C; Manufacturer Part Number: CRCW040210K0FKED; RoHS: Yes; Category: Chip SMD Resistors; Stock 1: 17500; Pricing 1: 100=0.04700, 500=0.04400, 1000=0.04000, 2500=0.03700, 5000=0.03300 (GBP); Resistor Type: Thick Film; Series: CRCW-HP; Ratings: AEC-Q200; RoHS Compliant: Yes; ComponentLink1URL: https://datasheet.ciiva.com/9052/crcwhpe3-9052616.pdf?src-supplier=Avnet; ComponentLink1Description: https://datasheet.ciiva.com/9052/crcwhpe3-9052616.pdf?src-supplier=Avnet; ComponentLink2URL: https://datasheet.ciiva.com/5550/crcwhpe3-46056-5550367.pdf?src-supplier=Mouser; ComponentLink2Description: https://datasheet.ciiva.com/5550/crcwhpe3-46056-5550367.pdf?src-supplier=Mouser; ComponentLink3URL: https://datasheet.ciiva.com/7725/crcwhpe3-7725759.pdf?src-supplier=Element14; ComponentLink3Description: https://datasheet.ciiva.com/7725/crcwhpe3-7725759.pdf?src-supplier=Element14; ComponentLink4URL: https://datasheet.ciiva.com/28588/1750852-28588877.pdf?src-supplier=Element14; ComponentLink4Description: https://datasheet.ciiva.com/28588/1750852-28588877.pdf?src-supplier=Element14; Supplier 1: Digikey; Supplier Part Number 1: 541-10.0KLCT-ND
R312 = CRCW040247R0FKED: 47 Ohms ±1% 0.063W, 1/16W Chip Resistor 0402 (1005 Metric) Automotive AEC-Q200 Thick Film; Manufacturer: Vishay Dale; Max Power Dissipation: 63mW; Voltage Rating: 50V; Temperature Coefficient: 100ppm/°C; Termination: SMD/SMT; Case/Package: 0402; Contact Plating: Tin; Number of Pins: 2; Width: 0.5mm; Height: 0.35mm; Case Code (Metric): 1005; Military Standard: Not; Features: Automotive AEC-Q200; Power Rating: 63mW; Lead Free: Lead Free; Depth: 0.5mm; Max Operating Temperature: 155°C; Min Operating Temperature: -55°C; Package Quantity: 10; Voltage Rating (DC): 50V; Composition: Thick Film; Mount: Surface Mount; Radiation Hardening: No; Length: 1mm; Packaging: Tape and Reel; Number of Terminations: 2; Case Code (Imperial): 0402; Manufacturer Part Number: CRCW040247R0FKED; Supplier 1: Mouser; Supplier Part Number 1: 71-CRCW0402-47-E3; Supplier 2: Digikey; Supplier Part Number 2: 541-47.0LCT-ND; Supplier 3: Digikey; Supplier Part Number 3: 541-47.0LDKR-ND; Supplier 4: Digikey; Supplier Part Number 4: 541-47.0LTR-ND
SW1-SW3 = PTS647SN50SMTR2LFS: Pushbutton, NO-MOM, 12V, 0.05A, SMT; Manufacturer: C&K; Category: Pushbutton; Length (mm): 6.5 ±0.20; Manufacturer Part Number: PTS647SN50SMTR2LFS; Rating: 12V,0.05A; Thickness (mm): 1.55 ±0.15; Width (mm): 4.5; Package Description: SMT; Supplier 1: Digi-Key; Supplier Part Number 1: PTS647SN50SMTR2LFSCT-ND; Status: *; Review: *
TP300-TP308 = Test Point: Test pad, 0.90mm circular pad; PCB Footprint: testpad_0p90mm; Length (mm): 0.90; Manufacturer: N/A; Manufacturer PN: N/A; Medical Grade MFR: N/A; Medical Grade MFR PN: N/A; Rating: N/A; Thickness (mm): N/A; Value: Test point; Width (mm): 0.90; Category: Test point; Status: *; Review: *
U300 U302 = 2N7001TQDCKRQ1: Voltage Level Translator, Automotive 1-bit dual-supply buffered voltage signal translator; Manufacturer: Texas Instruments; Operating Supply Current: 14 uA; Shutdown Capabilities: No; Category: Level Translator; Type: Unidirectional; Manufacturer Part Number: 2N7001TQDCKRQ1; Supplier: TBD; Supplier Part Number: TBD; Mounting Type: SMD; Height: 1.1 mm; Quiscent Current: 14 uA; Supplier 1: Digikey; Supplier Part Number 1: 296-2N7001TQDCKRQ1CT-ND; Supplier 2: Digikey; Supplier Part Number 2: 296-2N7001TQDCKRQ1DKR-ND; Supplier 3: Digikey; Supplier Part Number 3: 296-2N7001TQDCKRQ1TR-ND; Supplier 4: Mouser; Supplier Part Number 4: 595-2N7001TQDCKRQ1
U301 = NRF52840-QFAA-F-R7: IC RF TxRx + MCU 802.15.4, Bluetooth Bluetooth v5.0, Thread, Zigbee® 2.4GHz 48-VFQFN Exposed Pad; Manufacturer: Nordic Semiconductor; Category: MCU; Type: BLE MCU; Manufacturer Part Number: NRF52840-QFAA-F-R7; Mounting Type: SMD; Height: 0.9mm; Supplier 1: Digikey; Supplier Part Number 1: 4823-NRF52840-QFAA-F-RCT-ND
Y300 = ECS-320-10-48-CKY-TR: 32 MHz Â±10ppm Crystal 10pF 100 Ohms 4-SMD, No Lead; Manufacturer: ECS Inc.; Medical Grade MFR: TBD; Category: Crystal; Length (mm): 1.20; Manufacturer Part Number: ECS-320-10-48-CKY-TR; Medical Grade MFR PN: TBD; PCB Footprint: TBD; Rating: N/A; Thickness (mm): 0.33; Width (mm): 1.00; Package Description: 4-SMD, No Lead; Supplier 1: Digi-Key; Supplier Part Number 1: XC3036CT-ND; Status: *; Review: *
Y301 = ECS-.327-9-34B-C-TR: 32.768 kHz ±10ppm Crystal 9pF 70 kOhms 2-SMD, No Lead; Manufacturer: ECS Inc.; Category: Crystal; Length (mm): 3.20mm; Manufacturer Part Number: ECS-.327-9-34B-C-TR; Medical Grade MFR: -; Medical Grade MFR PN: -; PCB Footprint: -; Rating: N/A; Thickness (mm): 0.90mm; Width (mm): 1.50mm; Package Description: 2-SMD; Supplier 1: Digikey; Supplier Part Number 1: XC1949CT-ND